# Altium project Carte Balise.PrjPCB
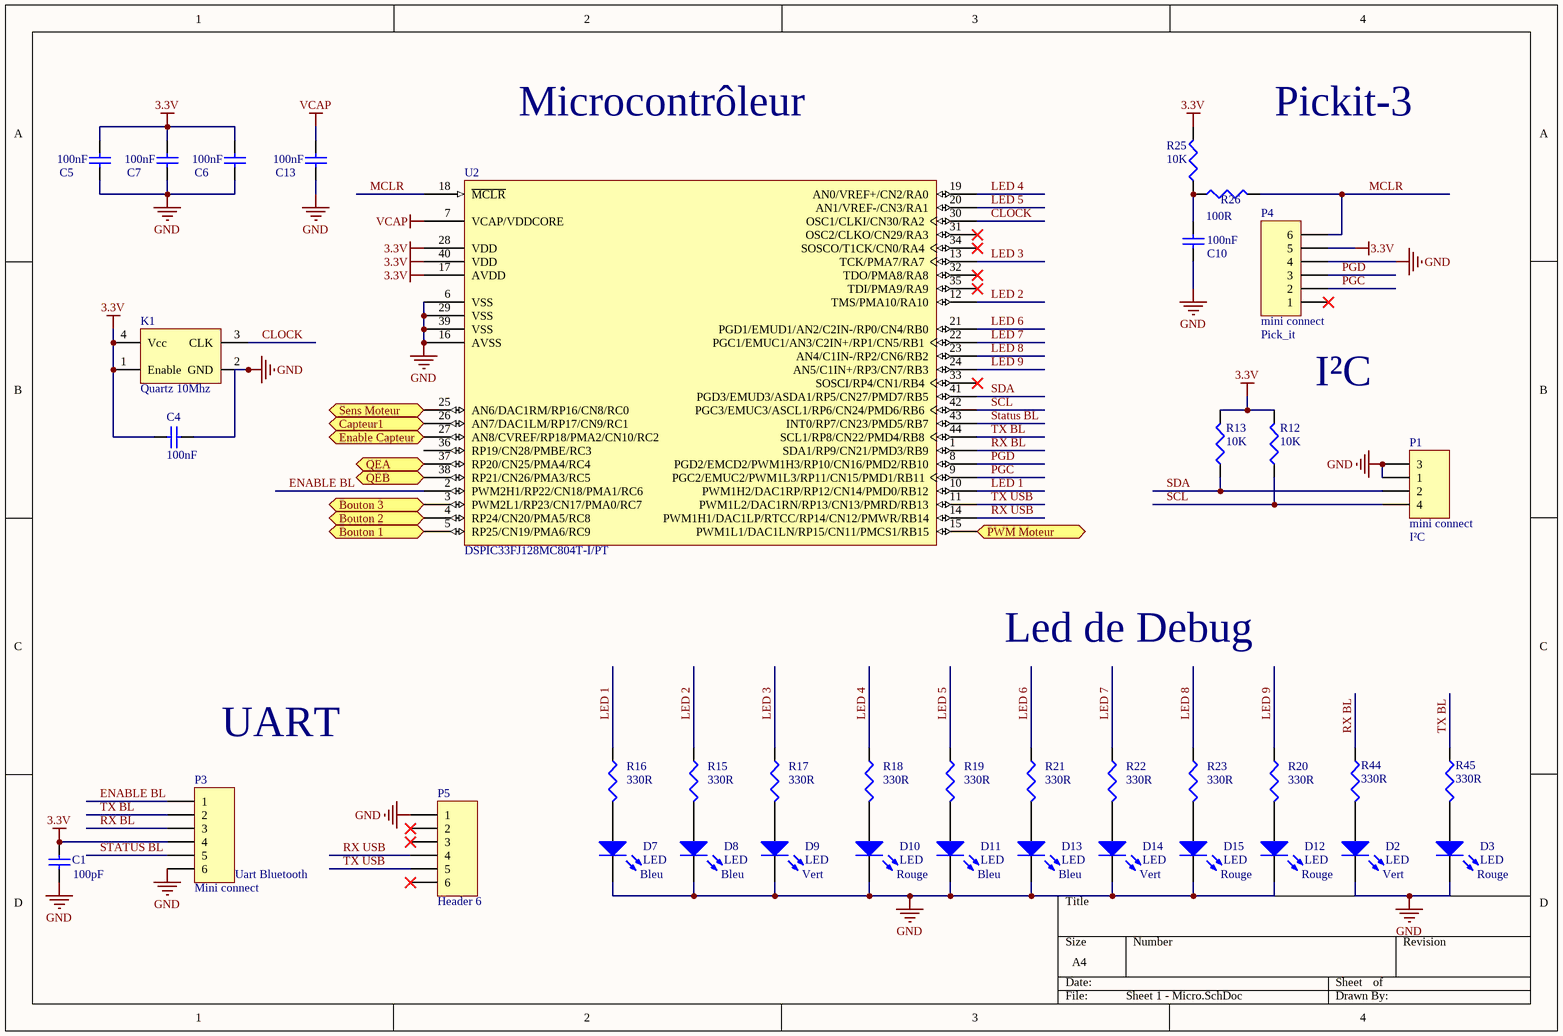
[diagram p0: Sheet 1 - Micro.SchDoc]
4 sheets, 101 parts. Net scope: flat (ports and power ports of the same name join across sheets).
Board file: PCB3 - 5x5 - placement V2.PcbDoc
Sheets:
  Sheet 1 - Micro.SchDoc
  Sheet 2 - Moteurs.SchDoc
  Sheet 3 - Alims.SchDoc
  Sheet 4 - Capteurs.SchDoc

## Sheet Sheet 1 - Micro.SchDoc
size A4

### Parts
C1  100pF  [C0805]
C4  100nF  [C0805]
C5  100nF  [C0805]
C6  100nF  [C0805]
C7  100nF  [C0805]
C10  value 100nF  [C0805]  (hidden comment: 0.1uF)
C13  100nF  [C0805]
D2  LED  value Vert  [LED 0805]
D3  LED  value Rouge  [LED 0805]
D7  LED  value Bleu  [LED 0805]
D8  LED  value Bleu  [LED 0805]
D9  LED  value Vert  [LED 0805]
D10  LED  value Rouge  [LED 0805]
D11  LED  value Bleu  [LED 0805]
D12  LED  value Rouge  [LED 0805]
D13  LED  value Bleu  [LED 0805]
D14  LED  value Vert  [LED 0805]
D15  LED  value Rouge  [LED 0805]
K1  Quartz 10Mhz  [IQXO-70]
P1  mini connect  value1: I²C  [690367280476]
P3  Mini connect  VALUE1: Uart Bluetooth  [690367280676]
P4  mini connect  value1: Pick_it  [690367280676]
P5  Header 6  [HDR1X6]
R12  10K  [0805]
R13  10K  [0805]
R15  330R  [0805]
R16  330R  [0805]
R17  330R  [0805]
R18  330R  [0805]
R19  330R  [0805]
R20  330R  [0805]
R21  330R  [0805]
R22  330R  [0805]
R23  330R  [0805]
R25  10K  [0805]
R26  100R  [0805]
R44  330R  [0805]
R45  330R  [0805]
U2  DSPIC33FJ128MC804T-I/PT  [TQFP-PT44_N]

### Ports
Bouton 1, Bouton 2, Bouton 3, Capteur1, Enable Capteur, PWM Moteur, QEA, QEB, Sens Moteur

### Nets
3.3V: C1.2 C4.2 C5.2 C6.2 C7.2 K1.1(Enable) K1.4(Vcc) P3.4 P4.5 R12.2 R13.2 R25.2 U2.17(AVDD) U2.28(VDD) U2.40(VDD)
GND: C1.1 C4.1 C5.1 C6.1 C7.1 C10.1 C13.1 D2.2(K) D3.2(K) D7.2(K) D8.2(K) D9.2(K) D10.2(K) D11.2(K) D12.2(K) D13.2(K) D14.2(K) D15.2(K) K1.2(GND) P1.1 P1.3 P3.6 P4.4 P5.1 U2.6(VSS) U2.16(AVSS) U2.29(VSS) U2.39(VSS)
VCAP: C13.2 U2.7(VCAP/VDDCORE)
B1: U2.5(RP25/CN19/PMA6/RC9) ; port Bouton 1
B2: U2.4(RP24/CN20/PMA5/RC8) ; port Bouton 2
B3: U2.3(PWM2L1/RP23/CN17/PMA0/RC7) ; port Bouton 3
Capteur: U2.26(AN7/DAC1LM/RP17/CN9/RC1) ; port Capteur1
CLOCK: K1.3(CLK) U2.30(OSC1/CLKI/CN30/RA2)
ENABLE BL: P3.1 U2.2(PWM2H1/RP22/CN18/PMA1/RC6)
Enable Capt: U2.27(AN8/CVREF/RP18/PMA2/CN10/RC2) ; port Enable Capteur
LED 1: R16.1 U2.10(PWM1H2/DAC1RP/RP12/CN14/PMD0/RB12)
LED 2: R15.1 U2.12(TMS/PMA10/RA10)
LED 3: R17.1 U2.13(TCK/PMA7/RA7)
LED 4: R18.1 U2.19(AN0/VREF+/CN2/RA0)
LED 5: R19.1 U2.20(AN1/VREF-/CN3/RA1)
LED 6: R21.1 U2.21(PGD1/EMUD1/AN2/C2IN-/RP0/CN4/RB0)
LED 7: R22.1 U2.22(PGC1/EMUC1/AN3/C2IN+/RP1/CN5/RB1)
LED 8: R23.1 U2.23(AN4/C1IN-/RP2/CN6/RB2)
LED 9: R20.1 U2.24(AN5/C1IN+/RP3/CN7/RB3)
MCLR: P4.6 R26.2 U2.18(~{MCLR})
PGC: P4.2 U2.9(PGC2/EMUC2/PWM1L3/RP11/CN15/PMD1/RB11)
PGD: P4.3 U2.8(PGD2/EMCD2/PWM1H3/RP10/CN16/PMD2/RB10)
PWM: U2.15(PWM1L1/DAC1LN/RP15/CN11/PMCS1/RB15) ; port PWM Moteur
QEA: U2.37(RP20/CN25/PMA4/RC4) ; port QEA
QEB: U2.38(RP21/CN26/PMA3/RC5) ; port QEB
RX BL: P3.3 R44.1 U2.1(SDA1/RP9/CN21/PMD3/RB9)
RX USB: P5.4 U2.14(PWM1H1/DAC1LP/RTCC/RP14/CN12/PMWR/RB14)
SCL: P1.4 R12.1 U2.42(PGC3/EMUC3/ASCL1/RP6/CN24/PMD6/RB6)
SDA: P1.2 R13.1 U2.41(PGD3/EMUD3/ASDA1/RP5/CN27/PMD7/RB5)
Sens mot: U2.25(AN6/DAC1RM/RP16/CN8/RC0) ; port Sens Moteur
Status BL: P3.5 U2.43(INT0/RP7/CN23/PMD5/RB7)
TX BL: P3.2 R45.1 U2.44(SCL1/RP8/CN22/PMD4/RB8)
TX USB: P5.5 U2.11(PWM1L2/DAC1RN/RP13/CN13/PMRD/RB13)
NetC10_2: C10.2 R25.1 R26.1
NetD2_1: D2.1(A) R44.2
NetD3_1: D3.1(A) R45.2
NetD7_1: D7.1(A) R16.2
NetD8_1: D8.1(A) R15.2
NetD9_1: D9.1(A) R17.2
NetD10_1: D10.1(A) R18.2
NetD11_1: D11.1(A) R19.2
NetD12_1: D12.1(A) R20.2
NetD13_1: D13.1(A) R21.2
NetD14_1: D14.1(A) R22.2
NetD15_1: D15.1(A) R23.2

Not connected (* = marked no-connect by the designer): P4 1*; P5 2* 3* 6*; U2 31(OSC2/CLKO/CN29/RA3)* 32(TDO/PMA8/RA8)* 33(SOSCI/RP4/CN1/RB4)* 34(SOSCO/T1CK/CN0/RA4)* 35(TDI/PMA9/RA9)* 36(RP19/CN28/PMBE/RC3)

### Notes on the sheet
- Microcontrôleur
- Pickit-3
- I²C
- Led de Debug
- UART

### Library data of the parts
C1 C4-C7 C10 C13 = Cap: Capacitor 0805; Published: 8-Jun-2000; LatestRevisionDate: 17-Jul-2002; LatestRevisionNote: Re-released for DXP Platform.; PackageReference: RAD-0.3; Publisher: Altium Limited
  C1: Value: 100pF
  C4-C7 C13: value: 100nF
D2 D3 D7-D15 = LED2: Typical RED, GREEN, YELLOW, AMBER GaAs LED 0805; Published: 8-Jun-2000; LatestRevisionDate: 17-Jul-2002; LatestRevisionNote: Re-released for DXP Platform.; PackageVersion: Feb-2002; PackageReference: 3.2X1.6X1.1; Publisher: Altium Limited
K1 = OSCILLATEUR: Oscillateur quartz; part number: 478-8625; value: 10Mhz; Supplier Part Number 1: 478-8625; Supplier 1: Farnell
P1 = MHDR1X4: Header, 4-Pin; value: 690367280476; LatestRevisionDate: 17-Jul-2002; LatestRevisionNote: Re-released for DXP Platform.; Publisher: Altium Limited; Supplier Part Number 1: 378-4710; Supplier 1: Farnell
P3 P4 = MHDR1X6: Header, 6-Pin; value: 690367280676; LatestRevisionDate: 17-Jul-2002; LatestRevisionNote: Re-released for DXP Platform.; Publisher: Altium Limited; Supplier Part Number 1: 129-1787; Supplier 1: Farnell
P5 = Header 6: Header, 6-Pin; value: 690367280676; LatestRevisionDate: 17-Jul-2002; LatestRevisionNote: Re-released for DXP Platform.; Publisher: Altium Limited; Supplier Part Number 1: 129-1787; Supplier 1: Farnell
R12 R13 = Res3: Resistor 0805; Value: 1K; Published: 8-Jun-2000; LatestRevisionDate: 29-May-2009; LatestRevisionNote: IPC-7351 Footprint Added.; PackageReference: J1-0603; Publisher: Altium Limited; PackageDescription: Chip Resistor
R15 R16 R19 R21 R25 R26 = Res3: Resistor 0805; Published: 8-Jun-2000; LatestRevisionDate: 29-May-2009; LatestRevisionNote: IPC-7351 Footprint Added.; PackageReference: J1-0603; Publisher: Altium Limited; PackageDescription: Chip Resistor
  R15 R16 R19 R21: Value: 330R
  R25: Value: 10K
  R26: value: 100R
R17 R18 R20 R22 R23 R44 R45 = Res3: Resistor 0805; Value: 470R; Published: 8-Jun-2000; LatestRevisionDate: 29-May-2009; LatestRevisionNote: IPC-7351 Footprint Added.; PackageReference: J1-0603; Publisher: Altium Limited; PackageDescription: Chip Resistor
U2 = DSPIC33FJ128MC804T-I/PT: High-Performance 16-bit Digital Signal Controller, 128 KB Flash, 16 KB RAM, 44-Pin TQFP, Industrial Temperature, Tape and Reel; FirstPublished: 29-Jan-2009; LatestRevisionDate: 02-Dec-2009; LatestRevisionNote: Updated to datasheet revision D, Nov-2009; DatasheetVersion: revD, Nov-2009; PackageVersion: revBB, Aug-2009; PackageReference: TQFP-PT44; Publisher: Altium Limited; PackageDescription: 44-Lead Plastic Thin Quad Flatpack (PT) - 10x10x1mm Body, 2.00mm [TQFP]; Supplier 1: farnell; Supplier Part Number 1: 157-6810; Supplier 2: Newark; Supplier Part Number 2: 39M8148; Code_JEDEC: MS-026; ComponentLink1Description: Datasheet; ComponentLink1URL: http://ww1.microchip.com/downloads/en/DeviceDoc/70291D.pdf; ComponentLink2Description: Packaging Specification; ComponentLink2URL: http://www.microchip.com/stellent/groups/techpub_sg/documents/packagingspec/en012702.pdf; ComponentLink3Description: Microchip.com Home; ComponentLink3URL: http://www.microchip.com/

## Sheet Sheet 2 - Moteurs.SchDoc
size A4
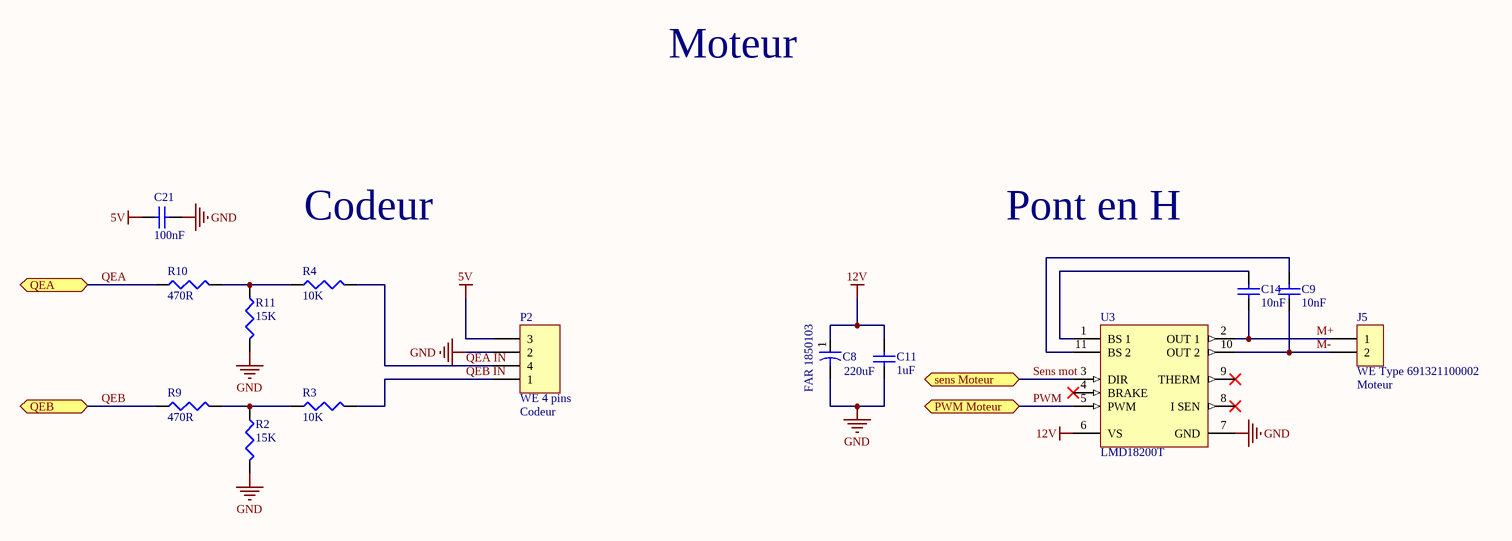
[diagram p1: Sheet 2 - Moteurs.SchDoc]

### Parts
C8  réference commande: FAR 1850103  [Capa CMS D6.3_E1.8]  (hidden comment: 220uF)
C9  10nF  [C0805]
C11  1uF  [C0805]
C14  10nF  [C0805]
C21  100nF  [C0805]
J5  WE Type 691321100002  value1: Moteur  [691321100002]
P2  WE 4 pins  value1: Codeur  [690367280476]
R2  15K  [0805]
R3  10K  [0805]
R4  10K  [0805]
R9  470R  [0805]
R10  470R  [0805]
R11  15K  [0805]
U3  LMD18200T  [TA11B]

### Ports
PWM Moteur (bidir), QEA (bidir), QEB (bidir), sens Moteur (bidir)

### Nets
5V: C21.2 P2.3
12V: C8.1 C11.2 U3.6(VS)
GND: C8.2 C11.1 C21.1 P2.2 R2.2 R11.2 U3.7(GND)
M+: C14.2 J5.1 U3.2(OUT_1)
M-: C9.2 J5.2 U3.10(OUT_2)
PWM: U3.5(PWM) ; port PWM Moteur
QEA: R10.1 ; port QEA
QEA IN: P2.4 R4.2
QEB: R9.1 ; port QEB
QEB IN: P2.1 R3.2
Sens mot: U3.3(DIR) ; port sens Moteur
NetC9_1: C9.1 U3.11(BS_2)
NetC14_1: C14.1 U3.1(BS_1)
NetR2_1: R2.1 R3.1 R9.2
NetR4_1: R4.1 R10.2 R11.1

Not connected (* = marked no-connect by the designer): U3 4(BRAKE)* 8(I_SEN)* 9(THERM)*

### Notes on the sheet
- Moteur
- Codeur
- Pont en H

### Library data of the parts
C8 = Cap2: EEEFK1C221XP; Published: 23-Sep-2002; PackageReference: CAPR5-4X5; Publisher: Altium Limited; Value: 220uF; Supplier 1: Farnell; Supplier Part Number 1: 185-0103
C9 C11 C14 C21 = Cap: Capacitor 0805; Published: 8-Jun-2000; LatestRevisionDate: 17-Jul-2002; LatestRevisionNote: Re-released for DXP Platform.; PackageReference: RAD-0.3; Publisher: Altium Limited
  C9 C14: Value: 10nF
  C11: Value: 1uF
  C21: value: 100nF
J5 = WE-Terminal Blocks Plugable Type 691321100002: WR-TBL Terminal block - serie 3211 - 3.50 mm; Manufacturer: W¨¹rth Elektronik eiSos GmbH; ComponentLink1 Description: Manufacturer; ComponentLink2 Description: Datasheet; NoPins: 2; Created Date: 9 December 2013; value: 691321100002; ComponentLink1URL: http://www.we-online.com; ComponentLink2URL: http://katalog.we-online.de/em/datasheet/6913211000xx.pdf; Created by: Karrer Zheng; Supplier Part Number 1: 3704816; Supplier 1: Farnell
P2 = MHDR1X4: Header, 4-Pin; value: 690367280476; LatestRevisionDate: 17-Jul-2002; LatestRevisionNote: Re-released for DXP Platform.; Publisher: Altium Limited; Supplier Part Number 1: 378-4710; Supplier 1: Farnell
R2 R3 R9 = Res3: Resistor 0805; Value: 1K; Published: 8-Jun-2000; LatestRevisionDate: 29-May-2009; LatestRevisionNote: IPC-7351 Footprint Added.; PackageReference: J1-0603; Publisher: Altium Limited; PackageDescription: Chip Resistor
R4 R10 R11 = Res3: Resistor 0805; Published: 8-Jun-2000; LatestRevisionDate: 29-May-2009; LatestRevisionNote: IPC-7351 Footprint Added.; PackageReference: J1-0603; Publisher: Altium Limited; PackageDescription: Chip Resistor
  R4: Value: 10K
  R10: Value: 470R
  R11: Value: 15k
U3 = LMD18200T: 3A, 55V H-Bridge; Manufacturer: National Semiconductor; CompType: MiscPower; PackageTopMarking: NSUZXYTTE#*LMD18200T*P+; PowerWise: N; FirstPublished: 4-Dec-2008; DatasheetVersion: Apr-2005; PackageVersion: revA, Mar-1987; PackageReference: TA11B; Publisher: Altium Limited; PackageDescription: TO-220, Molded, .788 x .421in Body, 11 Lead, .067in Pitch; Value: LMD18200T; RoHS: O; PinCount: 11; DigiKeyPartNumber: LMD18200T-ND; ComponentLink1Description: LMD18200 Datasheet; ComponentLink1URL: http://www.national.com/ds/LM/LMD18200.pdf; ComponentLink2Description: LMD18200 Web Page; ComponentLink2URL: http://www.national.com/pf/LM/LMD18200.html; ComponentLink3Description: TA11B Package Page; ComponentLink3URL: http://www.national.com/packaging/folders/ta11b.html; Supplier 1: Farnell; Supplier Part Number 1: 948-8030

## Sheet Sheet 3 - Alims.SchDoc
size A4
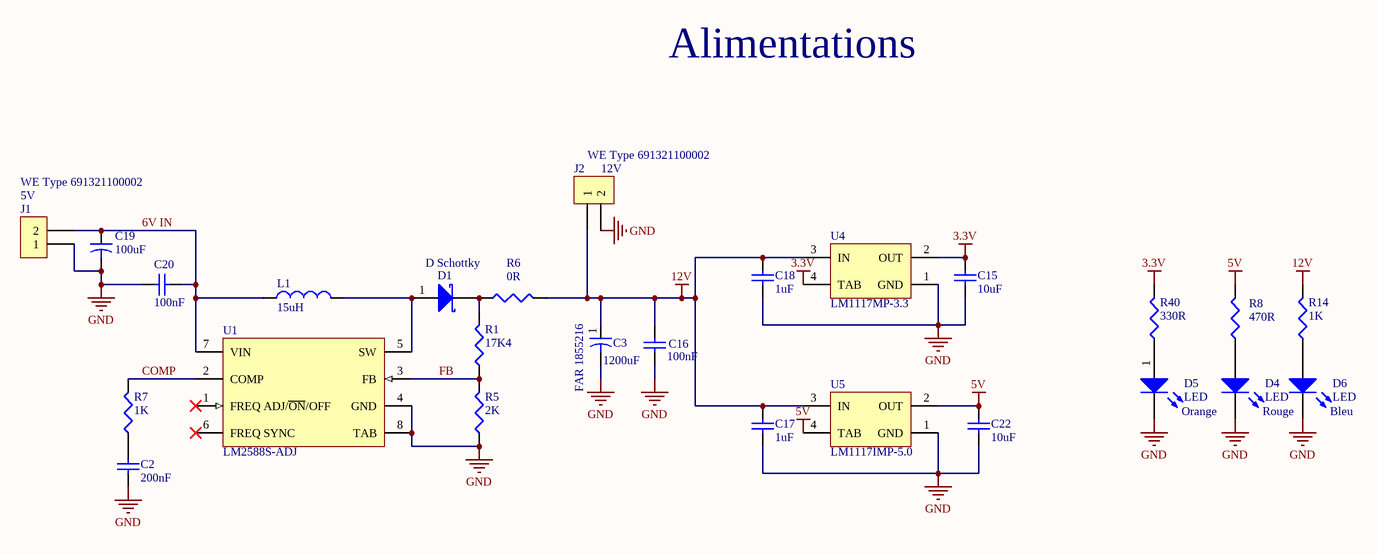
[diagram p2: Sheet 3 - Alims.SchDoc]

### Parts
C2  200nF  [C0805]
C3  1200uF  référence commande: FAR 1855216  [CAPA_D10_E5]
C15  10uF  [C0805]
C16  100nF  [C0805]
C17  1uF  [C0805]
C18  1uF  [C0805]
C19  100uF  [C1206]
C20  100nF  [C0805]
C22  10uF  [C0805]
D1  D Schottky  [D0805]
D4  LED  value Rouge  [LED 0805]
D5  LED  value Orange  [LED 0805]
D6  LED  value Bleu  [LED 0805]
J1  WE Type 691321100002  value1: 5V  [691321100002]
J2  WE Type 691321100002  value1: 12V  [691321100002]
L1  15uH  [Inductance 4.06 x 4.45]
R1  17K4  [0805]
R5  2K  [0805]
R6  0R  [0805]
R7  1K  [0805]
R8  470R  [0805]
R14  1K  [0805]
R40  330R  [0805]
U1  LM2588S-ADJ  [TS7B_N]
U4  LM1117MP-3.3  [MP04A_N]
U5  LM1117IMP-5.0  [MP04A_N]

### Nets
3.3V: C15.2 R40.2 U4.2(OUT) U4.4(TAB)
5V: C22.2 R8.2 U5.2(OUT) U5.4(TAB)
12V: C3.1 C16.2 C17.2 C18.2 J2.1 R6.2 R14.2 U4.3(IN) U5.3(IN)
GND: C2.1 C3.2 C15.1 C16.1 C17.1 C18.1 C19.2 C20.1 C22.1 D4.2(K) D5.2(K) D6.2(K) J1.2(1) J2.2 R5.1 U1.4(GND) U1.8(TAB) U4.1(GND) U5.1(GND)
6V IN: C19.1 C20.2 J1.1(2) L1.1 U1.7(VIN)
COMP: R7.2 U1.2(COMP)
FB: R1.1 R5.2 U1.3(FB)
NetC2_2: C2.2 R7.1
NetD1_1: D1.1(A) L1.2 U1.5(SW)
NetD1_2: D1.2(K) R1.2 R6.1
NetD4_1: D4.1(A) R8.1
NetD5_1: D5.1(A) R40.1
NetD6_1: D6.1(A) R14.1

Not connected (* = marked no-connect by the designer): U1 1(FREQ_ADJ/~{ON}/OFF)* 6(FREQ_SYNC)*

### Notes on the sheet
- Alimentations

### Library data of the parts
C2 C15-C18 C20 C22 = Cap: Capacitor 0805; Published: 8-Jun-2000; LatestRevisionDate: 17-Jul-2002; LatestRevisionNote: Re-released for DXP Platform.; PackageReference: RAD-0.3; Publisher: Altium Limited
  C2: Value: 200nF
  C15 C22: Value: 10uF
  C16 C20: Value: 100nF
  C17 C18: Value: 1uF
C3 = Cap2: EEUFM1C122L; Published: 23-Sep-2002; PackageReference: CAPR5-4X5; Publisher: Altium Limited; Value: 1200uF; Supplier 1: Farnell; Supplier Part Number 1: 185-5216
C19 = Cap2: Capacitor 1206; Published: 23-Sep-2002; PackageReference: CAPR5-4X5; Publisher: Altium Limited; Value: 100uF; reference farnell: 2211193; Supplier 1: Farnell; Supplier Part Number 1: 221-1193
D1 = D Schottky: Schottky Diode 0805; value: SD0805S040S0R5; Published: 8-Jun-2000; LatestRevisionDate: 17-Jul-2002; LatestRevisionNote: Re-released for DXP Platform.; PackageReference: SMB; Publisher: Altium Limited; Code_JEDEC: DO-214-AA; Supplier 1: Farnell; Supplier Part Number 1: 240-0203
D4-D6 = LED2: as D2 on sheet Sheet 1 - Micro; Published: 8-Jun-2000; LatestRevisionDate: 17-Jul-2002; LatestRevisionNote: Re-released for DXP Platform.; PackageVersion: Feb-2002; PackageReference: 3.2X1.6X1.1; Publisher: Altium Limited
J1 J2 = WE-Terminal Blocks Plugable Type 691321100002: as J5 on sheet Sheet 2 - Moteurs; Created Date: 9 December 2013; ComponentLink1URL: http://www.we-online.com; ComponentLink2URL: http://katalog.we-online.de/em/datasheet/6913211000xx.pdf; Created by: Karrer Zheng; value: 691321100002; Supplier Part Number 1: 3704816
  J1: partNo: 691321100002; Supplier 1: farnell
  J2: Supplier 1: Farnell
L1 = Inductor: SRP4020TA-150M; Code_IEC: 1005; Published: 8-Jun-2000; LatestRevisionDate: 29-May-2009; LatestRevisionNote: IPC-7351 Footprint Added.; PackageReference: 0402-A; Publisher: Altium Limited; PackageDescription: Chip Inductor; Code_JEITA: 0402; Value: 15uH; Supplier 1: farnell; Supplier Part Number 1: 243-4809
R1 R5-R8 R14 R40 = Res3: Resistor 0805; Published: 8-Jun-2000; LatestRevisionDate: 29-May-2009; LatestRevisionNote: IPC-7351 Footprint Added.; PackageReference: J1-0603; Publisher: Altium Limited; PackageDescription: Chip Resistor
  R1: Value: 17K4
  R5: Value: 2k
  R6: Value: 0R
  R7 R14: Value: 1K
  R8: Value: 470R
  R40: Value: 330R
U1 = LM2588S-ADJ: SIMPLE SWITCHER 5A Flyback Regulator with Shutdown; Manufacturer: National Semiconductor; PackageTopMarking: NSUZXYTT*LM2588S*-ADJ P+; PowerWise: N; FirstPublished: 4-Dec-2008; DatasheetVersion: Jul-2005; PackageVersion: revE, Jul-2003; PackageReference: TS7B; Publisher: Altium Limited; PackageDescription: TO-263, Molded, .400 x .390 x .180in Body, 7 Lead, .050in Pitch, Surface Mount; CompType: Switcher; PartNumber: LM2588S-ADJ; RoHS: O; PinCount: 7; DigiKeyPartNumber: LM2588S-ADJ-ND; Code_JEDEC: MO-169-AC; ComponentLink1Description: LM2588 Datasheet; ComponentLink1URL: http://www.national.com/ds/LM/LM2588.pdf; ComponentLink2Description: LM2588 Web Page; ComponentLink2URL: http://www.national.com/pf/LM/LM2588.html; ComponentLink3Description: TS7B Package Page; ComponentLink3URL: http://www.national.com/packaging/folders/ts7b.html; Supplier 1: Farnell; Supplier Part Number 1: 232-3492; Supplier 2: RS; Supplier Part Number 2: 533-3412; value: LM2588S-ADJ
U4 = LM1117MP-3.3: 800mA Low-Dropout Linear Regulator; Manufacturer: National Semiconductor; CompType: LDO IC; PackageTopMarking: XYTT*N05A; PowerWise: N; Published: 4-Dec-2008; DatasheetVersion: Apr-2006; PackageVersion: revB, Apr-2003; PackageReference: MP04A; Publisher: Altium Limited; PackageDescription: Molded SOT-223, 6.50 x 3.56 x 1.6mm Body, 4 Lead, 2.3mm Pitch; PartNumber: LM1117MP-3.3; RoHS: O; PinCount: 4; DigiKeyPartNumber: LM1117MP-3.3CT-ND; Code_JEDEC: TO-261-AA; Code_IPC: SOT223-4; ComponentLink1Description: LM1117 Datasheet; ComponentLink1URL: http://www.national.com/ds/LM/LM1117.pdf; ComponentLink2Description: LM1117 Web Page; ComponentLink2URL: http://www.national.com/pf/LM/LM1117.html; ComponentLink3Description: MP04A Package Page; ComponentLink3URL: http://www.national.com/packaging/folders/mp04a.html; Supplier Part Number 1: 977-8195; Supplier 1: Farnell; value: LM1117MP-3.3
U5 = LM1117IMP-5.0: 800mA Low-Dropout Linear Regulator; Manufacturer: National Semiconductor; CompType: LDO IC; PackageTopMarking: XYTT*N06B; PowerWise: N; Published: 4-Dec-2008; DatasheetVersion: Apr-2006; PackageVersion: revB, Apr-2003; PackageReference: MP04A; Publisher: Altium Limited; PackageDescription: Molded SOT-223, 6.50 x 3.56 x 1.6mm Body, 4 Lead, 2.3mm Pitch; PartNumber: LM1117IMP-5.0; RoHS: O; PinCount: 4; DigiKeyPartNumber: LM1117IMP-5.0CT-ND; Code_JEDEC: TO-261-AA; Code_IPC: SOT223-4; ComponentLink1Description: LM1117 Datasheet; ComponentLink1URL: http://www.national.com/ds/LM/LM1117.pdf; ComponentLink2Description: LM1117 Web Page; ComponentLink2URL: http://www.national.com/pf/LM/LM1117.html; ComponentLink3Description: MP04A Package Page; ComponentLink3URL: http://www.national.com/packaging/folders/mp04a.html; Supplier Part Number 1: 240-0655; Supplier 1: Farnell; value: LM1117IMP-5.0

## Sheet Sheet 4 - Capteurs.SchDoc
size A4
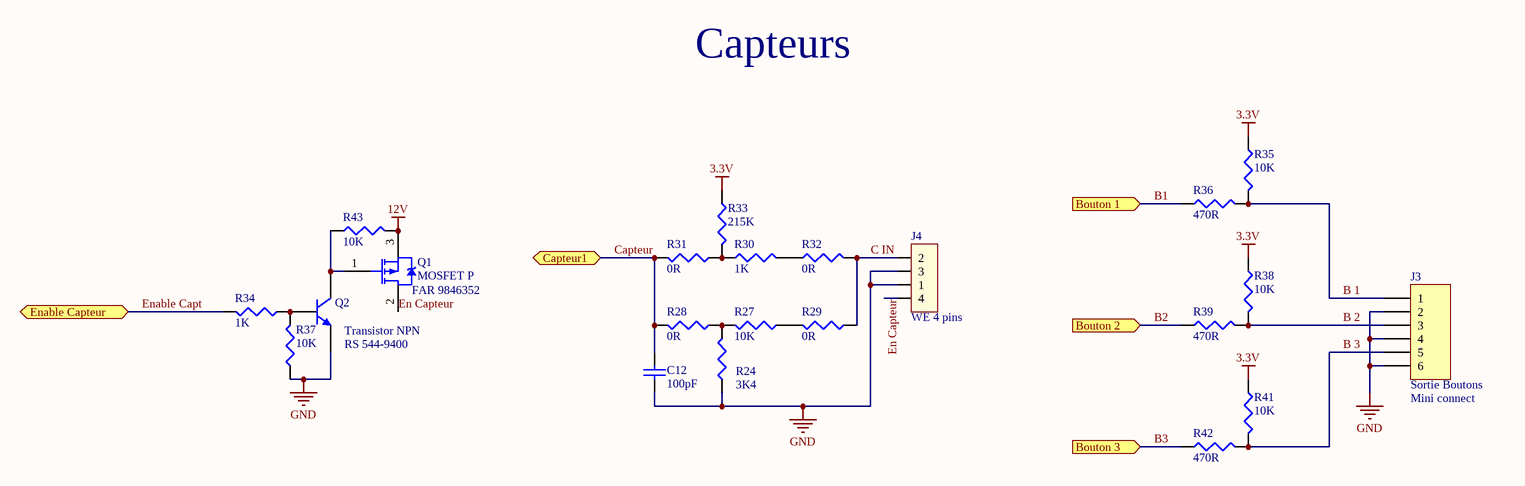
[diagram p3: Sheet 4 - Capteurs.SchDoc]

### Parts
C12  100pF  [C0805]
J3  Mini connect  VALUE1: Sortie Boutons  [690367280676]
J4  WE 4 pins  [690367280476]
Q1  MOSFET P  référence commande: FAR 9846352  [SOT-23]
Q2  Transistor NPN  référence commande: RS 544-9400  [SOT23_L]
R24  3K4  [0805]
R27  10K  [0805]
R28  0R  [0805]
R29  0R  [0805]
R30  1K  [0805]
R31  0R  [0805]
R32  0R  [0805]
R33  215K  [0805]
R34  1K  [0805]
R35  10K  [0805]
R36  470R  [0805]
R37  10K  [0805]
R38  10K  [0805]
R39  470R  [0805]
R41  10K  [0805]
R42  470R  [0805]
R43  10K  [0805]

### Ports
Bouton 1 (in), Bouton 2 (in), Bouton 3 (in), Capteur1 (bidir), Enable Capteur (bidir)

### Nets
3.3V: R33.1 R35.1 R38.1 R41.1
12V: Q1.3(S) R43.2
GND: C12.2 J3.2 J3.4 J3.6 J4.1 J4.3 Q2.2(E) R24.1 R37.1
B1: R36.1 ; port Bouton 1
B2: R39.1 ; port Bouton 2
B3: R42.1 ; port Bouton 3
B 1: J3.1 R35.2 R36.2
B 2: J3.3 R38.2 R39.2
B 3: J3.5 R41.2 R42.2
C IN: J4.2 R29.1 R32.2
Capteur: C12.1 R28.2 R31.2 ; port Capteur1
En Capteur: J4.4 Q1.2(D)
Enable Capt: R34.2 ; port Enable Capteur
NetQ1_1: Q1.1(G) Q2.3(C) R43.1
NetQ2_1: Q2.1(B) R34.1 R37.2
NetR24_2: R24.2 R27.2 R28.1
NetR27_1: R27.1 R29.2
NetR30_1: R30.1 R31.1 R33.2
NetR30_2: R30.2 R32.1

### Notes on the sheet
- Capteurs

### Library data of the parts
C12 = Cap: Capacitor 0805; Published: 8-Jun-2000; LatestRevisionDate: 17-Jul-2002; LatestRevisionNote: Re-released for DXP Platform.; PackageReference: RAD-0.3; Publisher: Altium Limited; Value: 100pF
J3 = MHDR1X6: Header, 6-Pin; value: 690367280676; LatestRevisionDate: 17-Jul-2002; LatestRevisionNote: Re-released for DXP Platform.; Publisher: Altium Limited; Supplier Part Number 1: 129-1787; Supplier 1: Farnell
J4 = MICRO-MATCH FOB.04P: connecteur WE; value: 690367280476; Supplier Part Number 1: 378-4710; Supplier 1: Farnell
Q1 = PMOS-2: P-Channel Power MOSFET; pin to pad: 1>2 2>1; Note: Pin 4 not drawn and electrically connected to Pin 2.; value: NDS0605; Published: 8-Jun-2000; LatestRevisionDate: 17-Jul-2002; LatestRevisionNote: Re-released for DXP Platform.; DatasheetVersion: PD-9.390D; PackageReference: TO-220AB; Publisher: Altium Limited; Code_JEDEC: TO-220-AB; ComponentLink1Description: Manufacturer Link; ComponentLink1URL: http://www.irf.com/; Supplier Part Number 1: 984-6352; Supplier 1: Farnell
Q2 = QNPN: NPN Bipolar Transistor; value: MMBT2222ALT1G; Published: 8-Jun-2000; LatestRevisionDate: 29-May-2009; LatestRevisionNote: IPC-7351 Footprint Added.; PackageVersion: Aug-1999; PackageReference: SOT-23B; Publisher: Altium Limited; PackageDescription: 3-Pin SOT-23 Package 0.95 mm Pitch, 2.4 mm Lead Span; Supplier Part Number 1: 544-9400; Supplier 1: RS
R24 R27-R34 R37 R43 = Res3: Resistor 0805; Published: 8-Jun-2000; LatestRevisionDate: 29-May-2009; LatestRevisionNote: IPC-7351 Footprint Added.; PackageReference: J1-0603; Publisher: Altium Limited; PackageDescription: Chip Resistor
  R24: Value: 3k4
  R27 R37 R43: Value: 10K
  R28 R29 R31 R32: Value: 0R
  R30 R34: Value: 1K
  R33: Value: 215K
R35 R36 R38 R39 R41 R42 = Res3: Resistor 0805; Value: 0R; Published: 8-Jun-2000; LatestRevisionDate: 29-May-2009; LatestRevisionNote: IPC-7351 Footprint Added.; PackageReference: J1-0603; Publisher: Altium Limited; PackageDescription: Chip Resistor

## Nets that join several sheets
3.3V: Sheet 1 - Micro (15 pins), Sheet 3 - Alims (C15.2 R40.2 U4.2 U4.4), Sheet 4 - Capteurs (R33.1 R35.1 R38.1 R41.1)
5V: Sheet 2 - Moteurs (C21.2 P2.3), Sheet 3 - Alims (C22.2 R8.2 U5.2 U5.4)
12V: Sheet 2 - Moteurs (C8.1 C11.2 U3.6), Sheet 3 - Alims (9 pins), Sheet 4 - Capteurs (Q1.3 R43.2)
GND: Sheet 1 - Micro (28 pins), Sheet 2 - Moteurs (7 pins), Sheet 3 - Alims (19 pins), Sheet 4 - Capteurs (9 pins)
B1: Sheet 1 - Micro (U2.5), Sheet 4 - Capteurs (R36.1)
B2: Sheet 1 - Micro (U2.4), Sheet 4 - Capteurs (R39.1)
B3: Sheet 1 - Micro (U2.3), Sheet 4 - Capteurs (R42.1)
Capteur: Sheet 1 - Micro (U2.26), Sheet 4 - Capteurs (C12.1 R28.2 R31.2)
Enable Capt: Sheet 1 - Micro (U2.27), Sheet 4 - Capteurs (R34.2)
PWM: Sheet 1 - Micro (U2.15), Sheet 2 - Moteurs (U3.5)
QEA: Sheet 1 - Micro (U2.37), Sheet 2 - Moteurs (R10.1)
QEB: Sheet 1 - Micro (U2.38), Sheet 2 - Moteurs (R9.1)
Sens mot: Sheet 1 - Micro (U2.25), Sheet 2 - Moteurs (U3.3)